# Altium schematic sheet Main control board.SchDoc
size A1
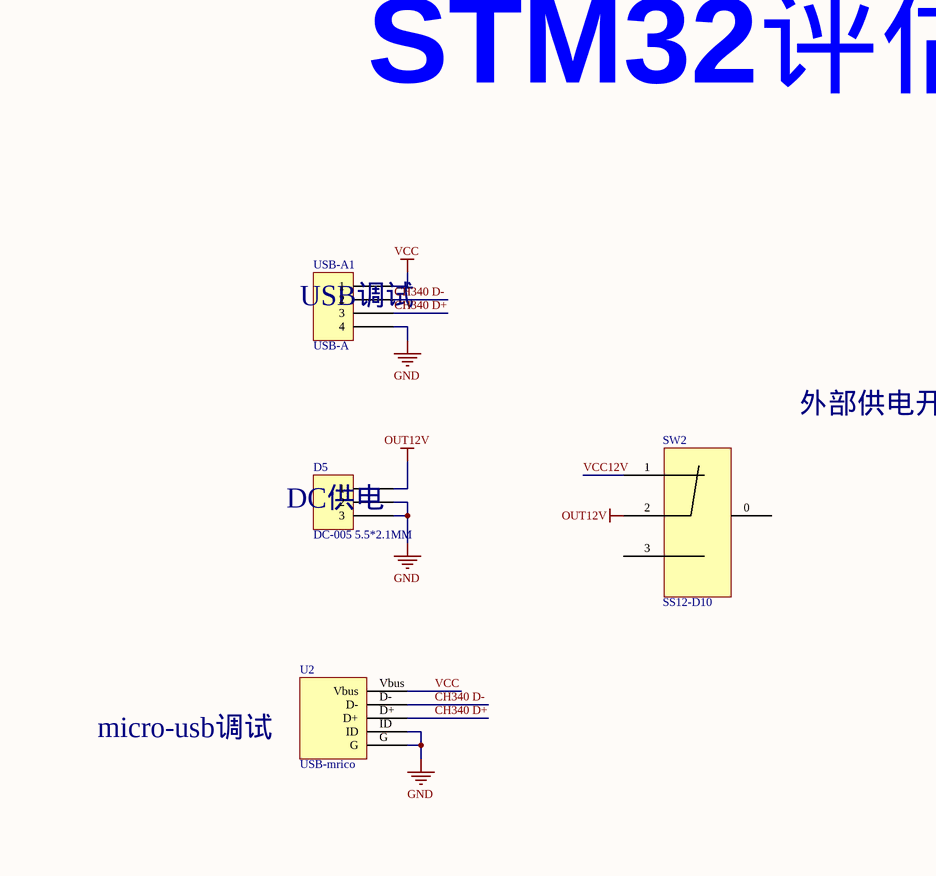
[diagram p0: Main control board.SchDoc, top left]
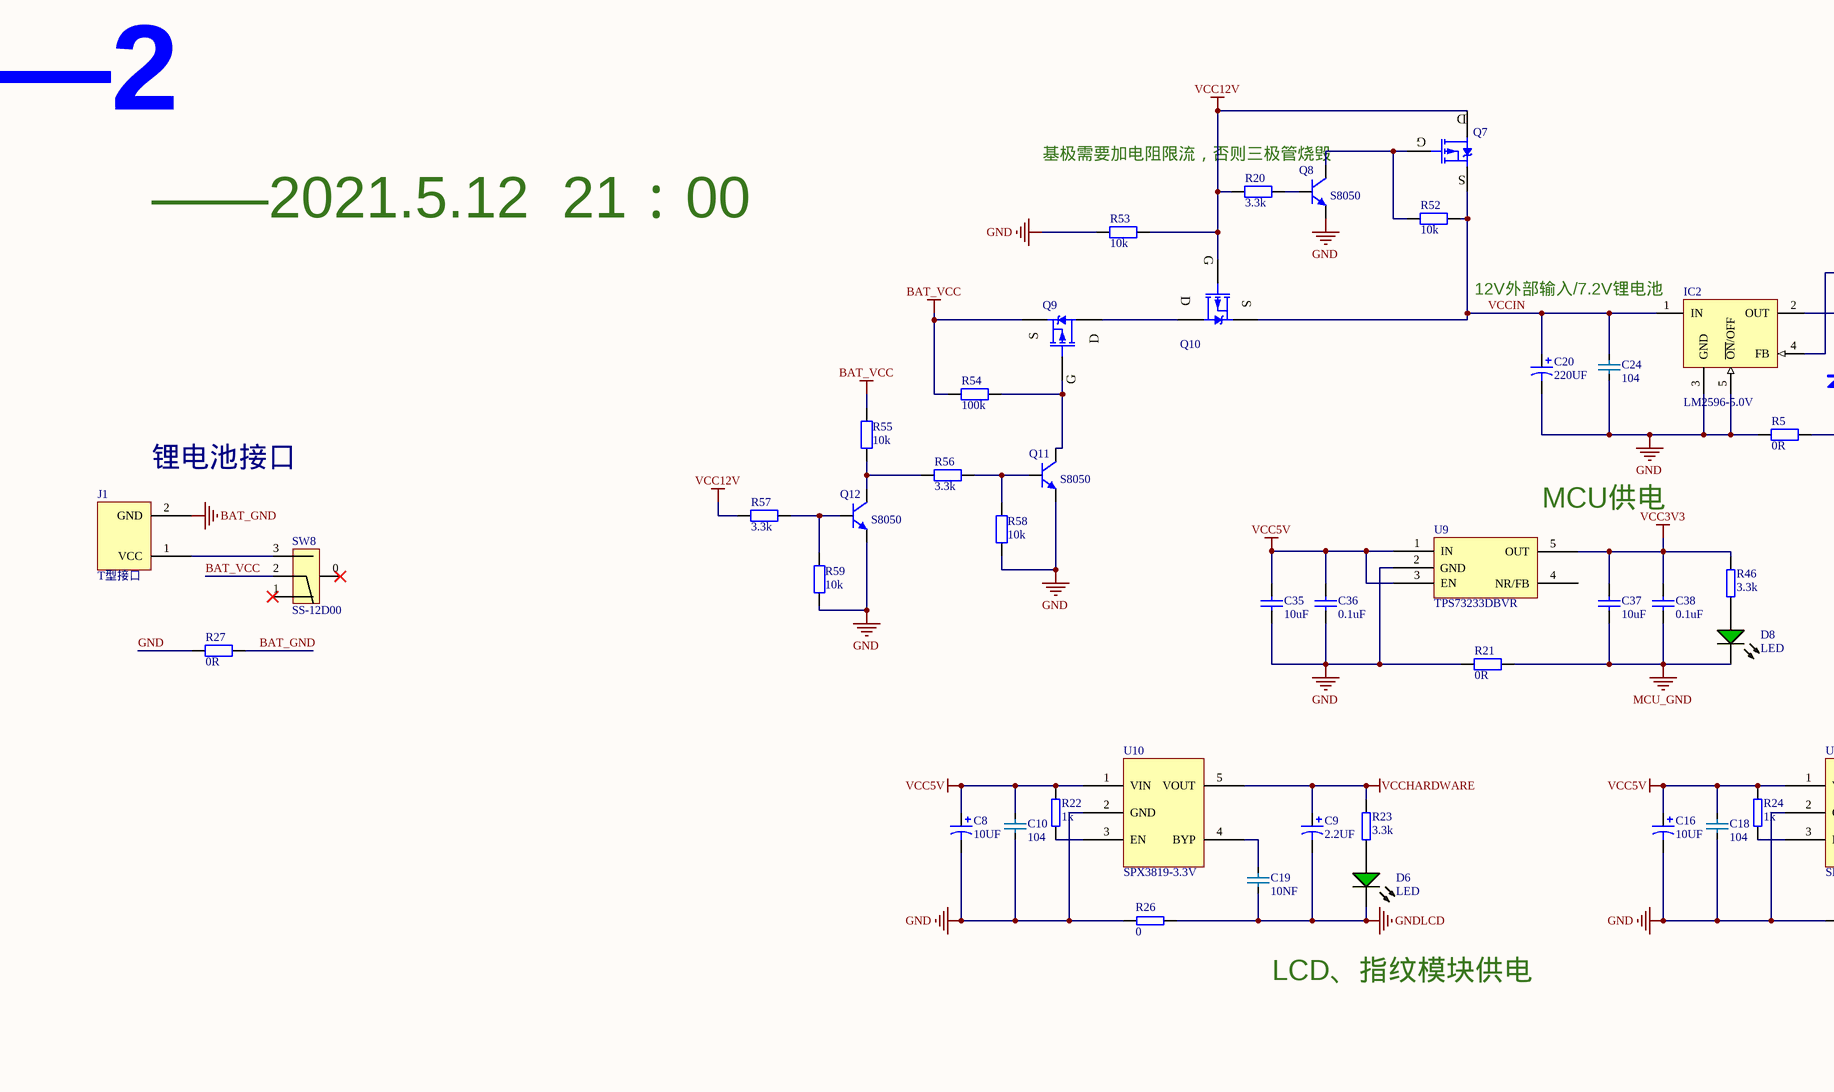
[diagram p1: Main control board.SchDoc, top middle]
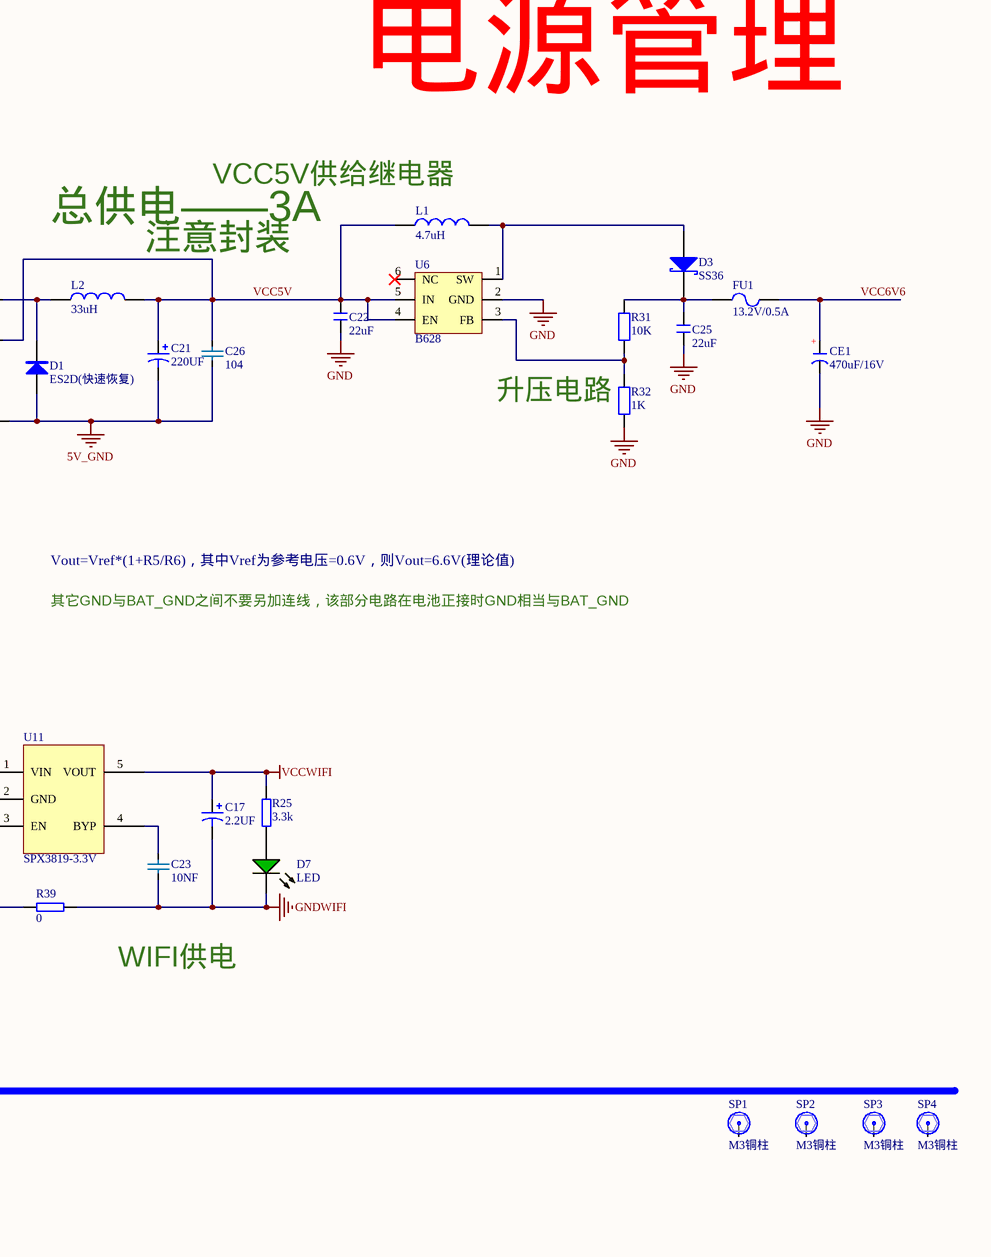
[diagram p2: Main control board.SchDoc, top right]
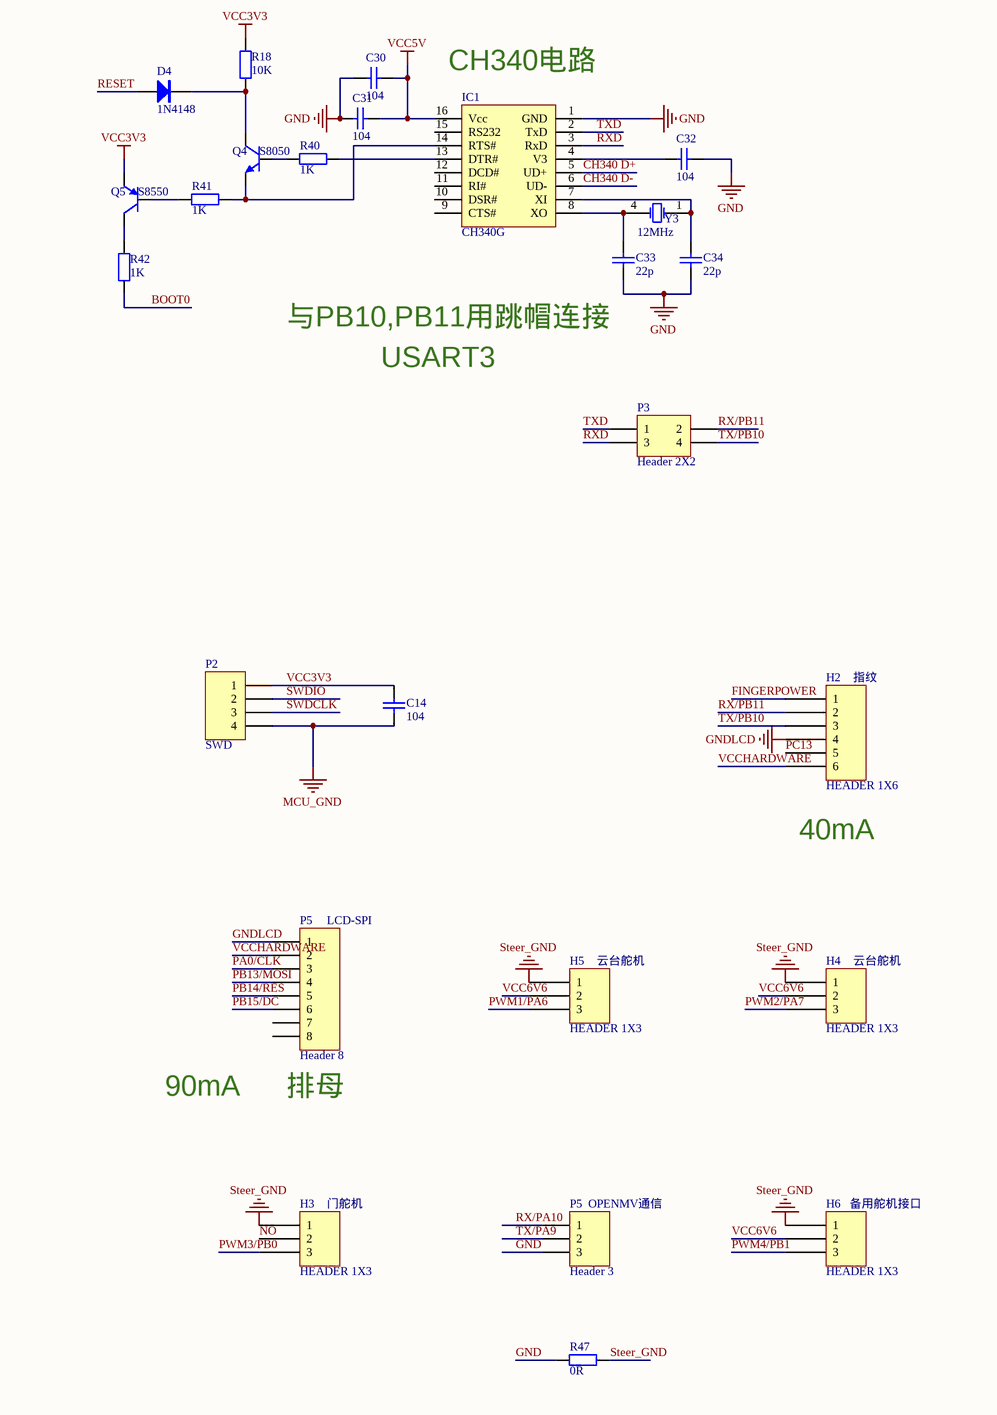
[diagram p3: Main control board.SchDoc, bottom left]
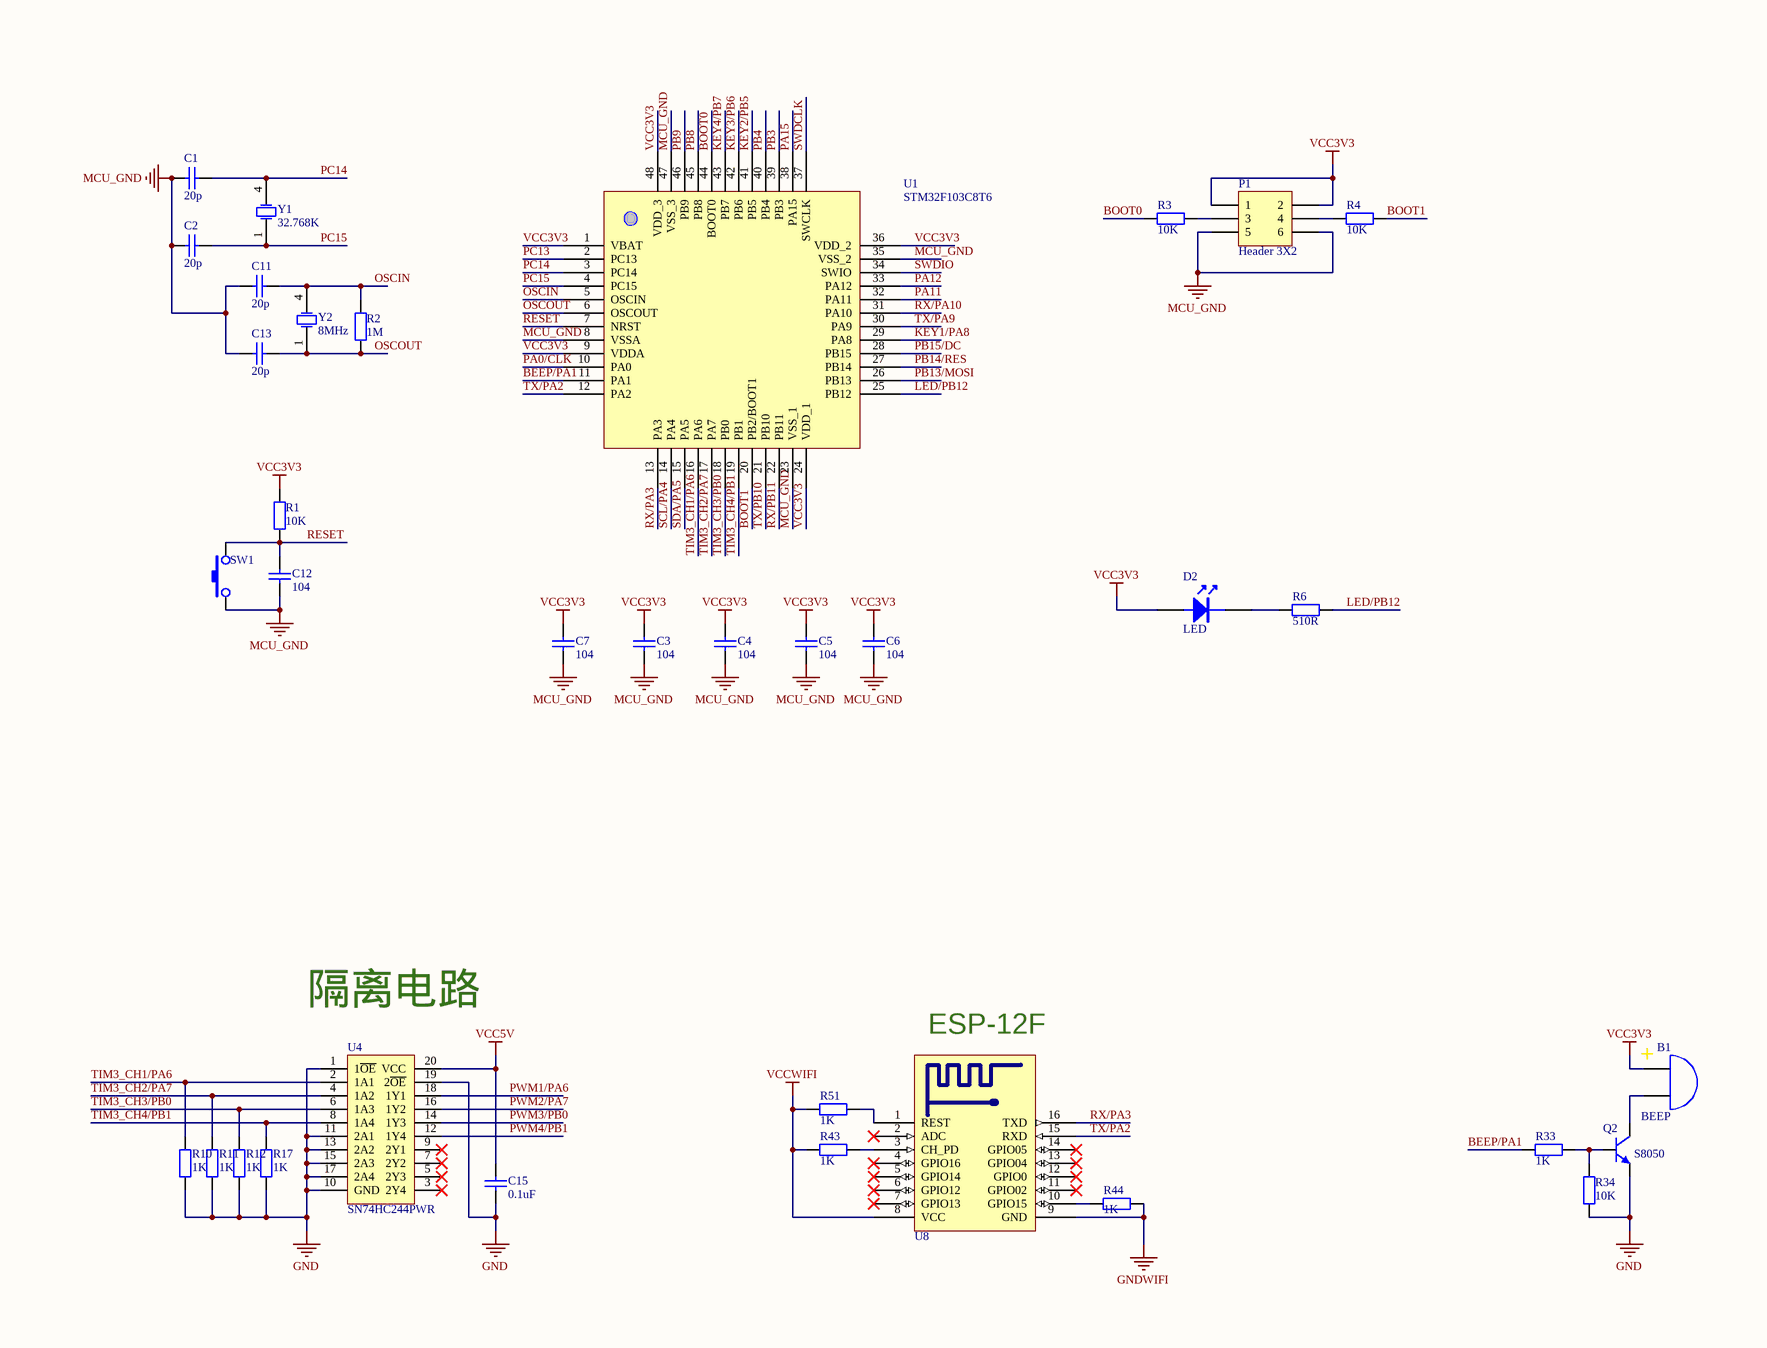
[diagram p4: Main control board.SchDoc, bottom middle]
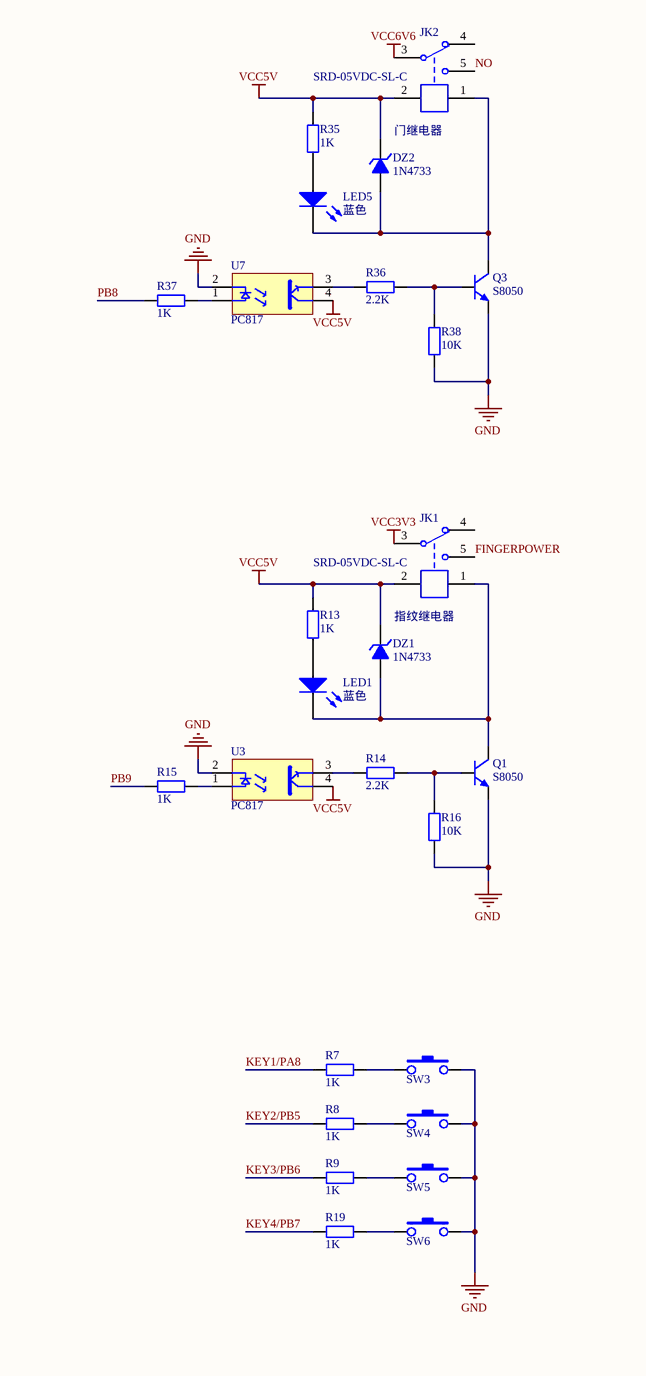
[diagram p5: Main control board.SchDoc, bottom right]

## Parts
B1  BEEP  [BEEP 7.6x12x7.5]
C1  20p  [0603C]
C2  20p  [0603C]
C3  104  [0603C]
C4  104  [0603C]
C5  104  [0603C]
C6  104  [0603C]
C7  104  [0603C]
C8  10UF  [1206C]
C9  2.2UF  [1206C]
C10  104  [0603C]
C11  20p  [0603C]
C12  104  [0603C]
C13  20p  [0603C]
C14  104  [0603C]
C15  0.1uF  [0603C]
C16  10UF  [1206C]
C17  2.2UF  [1206C]
C18  104  [0603C]
C19  10NF  [0603C]
C20  220UF  [1206C]
C21  220UF  [1206C]
C22  22uF  [0603C]
C23  10NF  [0603C]
C24  104  [0603C]
C25  22uF  [0603C]
C26  104  [0603C]
C30  104  [0603C]
C31  104  [0603C]
C32  104  [0603C]
C33  22p  [0603C]
C34  22p  [0603C]
C35  10uF  [0603C]
C36  0.1uF  [0603C]
C37  10uF  [0603C]
C38  0.1uF  [0603C]
CE1  470uF/16V  [CAP8]
D1  ES2D(快速恢复)  [SMA]
D2  LED  [LED 0805]
D3  SS36  [SMA]
D4  1N4148  [MINI_MELF (LL34)]
D5  DC-005 5.5*2.1MM  [DC-005]
D6  LED  [LED 0805G]
D7  LED  [LED 0805G]
D8  LED  [LED 0805G]
DZ1  1N4733  [MELF (LL41)]
DZ2  1N4733  [MELF (LL41)]
FU1  13.2V/0.5A  [FU 1206]
H2  HEADER 1X6  [XH2.54-LI-6P]
H3  HEADER 1X3  [XH2.54-LI-3P]
H4  HEADER 1X3  [XH2.54-LI-3P]
H5  HEADER 1X3  [XH2.54-LI-3P]
H6_备用舵机接口  HEADER 1X3  [XH2.54-LI-3P]
IC1  CH340G  [SOP16_L]
IC2  LM2596-5.0V  [TO263-5A]
J1  T型接口  [T型头封装]
JK1  SRD-05VDC-SL-C  [SRD-C_B]
JK2  SRD-05VDC-SL-C  [SRD-C_B]
L1  4.7uH  [CDRH74]
L2  33uH  [CDRH74]
LED1  蓝色  [LED 0805]
LED5  蓝色  [LED 0805]
P1  Header 3X2  [HDR2X3]
P2  SWD  [XH2.54-LI-4P]
P3  Header 2X2  [HDR2X2]
P5  Header 8  [HDR1X8]
P5_OPENMV通信  Header 3  [XH2.54-LI-3P]
Q1  S8050  [SOT23-3M]
Q2  S8050  [SOT23-3M]
Q3  S8050  [SOT23-3M]
Q4  S8050  [SOT23-3M]
Q5  S8550  [SOT23-3N]
Q7  D15P05  [TO252]  (value not drawn)
Q8  S8050  [SOT23-3M]
Q9  D15P05  [TO252]  (value not drawn)
Q10  D15P05  [TO252]  (value not drawn)
Q11  S8050  [SOT23-3M]
Q12  S8050  [SOT23-3M]
R1  10K  [0603R]
R2  1M  [0603R]
R3  10K  [0603R]
R4  10K  [0603R]
R5  0R  [0603R]
R6  510R  [0603R]
R7  1K  [0603R]
R8  1K  [0603R]
R9  1K  [0603R]
R10  1K  [0603R]
R11  1K  [0603R]
R12  1K  [0603R]
R13  1K  [0603R]
R14  2.2K  [0603R]
R15  1K  [0603R]
R16  10K  [0603R]
R17  1K  [0603R]
R18  10K  [0603R]
R19  1K  [0603R]
R20  3.3k  [0603R]
R21  0R  [0603R]
R22  1k  [0603R]
R23  3.3k  [0603R]
R24  1k  [0603R]
R25  3.3k  [0603R]
R26  0  [0603R]
R27  0R  [0603R]
R31  10K  [0603R]
R32  1K  [0603R]
R33  1K  [0603R]
R34  10K  [0603R]
R35  1K  [0603R]
R36  2.2K  [0603R]
R37  1K  [0603R]
R38  10K  [0603R]
R39  0  [0603R]
R40  1K  [0603R]
R41  1K  [0603R]
R42  1K  [0603R]
R43  1K  [0603R]
R44  1K  [0603R]
R46  3.3k  [0603R]
R47  0R  [0603R]
R51  1K  [0603R]
R52  10k  [0603R]
R53  10k  [0603R]
R54  100k  [0603R]
R55  10k  [0603R]
R56  3.3k  [0603R]
R57  3.3k  [0603R]
R58  10k  [0603R]
R59  10k  [0603R]
SP1  M3铜柱  [M3x4+6_N]
SP2  M3铜柱  [M3x4+6_N]
SP3  M3铜柱  [M3x4+6_N]
SP4  M3铜柱  [M3x4+6_N]
SW1  SW-PB_V  [TSW SMD-3*6*2.5]  (value not drawn)
SW2  SS12-D10  [SS-12D10]
SW3  SW-PB_V  [TSW SMD-3*6*2.5]  (value not drawn)
SW4  SW-PB_V  [TSW SMD-3*6*2.5]  (value not drawn)
SW5  SW-PB_V  [TSW SMD-3*6*2.5]  (value not drawn)
SW6  SW-PB_V  [TSW SMD-3*6*2.5]  (value not drawn)
SW8  SS-12D00  [SS-12D10]
U1  STM32F103C8T6  [48P]
U2  USB-mrico  [Micro_USB]
U3  PC817  [PC817C]
U4  SN74HC244PWR  [SOP20_L]
U6  B628  [B628]
U7  PC817  [PC817C]
U8  ESP-12  [ESP12]  (value not drawn)
U9  TPS73233DBVR  [SOT23-5]
U10  SPX3819-3.3V  [SOT23-5]
U11  SPX3819-3.3V  [SOT23-5]
USB-A1  USB-A  [USB-A/S_C]
Y1  32.768K  [MC-306]
Y2  8MHz  [OSC HC-49SMD]
Y3  12MHz  [OSC HC-49SMD]

## Nets
5V_GND: C21.2 C26.1 D1.1(A) R5.2
BAT_GND: J1.2(GND) R27.1
BAT_VCC: Q9.3(S) R54.1 R55.1 SW8.2
GND: C8.2 C10.1 C15.1 C16.2 C18.1 C20.2 C22.1 C24.1 C25.1 C30.2 C31.2 C32.1 C33.1 C34.1 C35.1 C36.1 CE1.2(K) D5.2 D5.3 IC1.1(GND) IC2.3(GND) IC2.5(~{ON}/OFF) P5_OPENMV通信.3 Q1.1(E) Q2.1(E) Q3.1(E) Q8.1(E) Q11.1(E) Q12.1(E) R5.1 R10.2 R11.2 R12.2 R16.2 R17.2 R21.1 R26.1 R27.2 R32.1 R34.1 R38.2 R39.1 R47.1 R53.1 R58.1 R59.2 SW3.2 SW4.2 SW5.2 SW6.2 U2.G U2.ID U3.2(IN-) U4.1(1~{OE}) U4.10(GND) U4.11(2A1) U4.13(2A2) U4.15(2A3) U4.17(2A4) U4.19(2~{OE}) U6.2(GND) U7.2(IN-) U9.2(GND) U10.2(GND) U11.2(GND) USB-A1.4
GNDLCD: C9.2 C19.1 D6.2(K) H2.4 P5.1 R26.2
GNDWIFI: C17.2 C23.1 D7.2(K) R39.2 R44.2 U8.9(GND)
MCU_GND: C1.1 C2.1 C3.1 C4.1 C5.1 C6.1 C7.1 C11.1 C12.1 C13.1 C14.1 C37.1 C38.1 D8.2(K) P1.5 P1.6 P2.4 R21.2 SW1.1 U1.8(VSSA) U1.23(VSS_1) U1.35(VSS_2) U1.47(VSS_3)
OUT12V: D5.1 SW2.2
Steer_GND: H3.1 H4.1 H5.1 H6_备用舵机接口.1 R47.2
VCC: U2.Vbus USB-A1.1
VCC3V3: B1.1 C3.2 C4.2 C5.2 C6.2 C7.2 C14.2 C37.2 C38.2 D2.A JK1.3 P1.1 P1.2 P2.1 Q5.2(E) R1.2 R18.2 R46.2 U1.1(VBAT) U1.9(VDDA) U1.24(VDD_1) U1.36(VDD_2) U1.48(VDD_3) U9.5(OUT)
VCC5V: C8.1 C10.2 C15.2 C16.1 C18.2 C21.1 C22.2 C26.2 C30.1 C31.1 C35.2 C36.2 DZ1.2(K) DZ2.2(K) IC1.16(Vcc) IC2.4(FB) JK1.2 JK2.2 L1.2 L2.1 R13.1 R22.2 R24.2 R35.1 U3.4(OUT) U4.20(VCC) U6.4(EN) U6.5(IN) U7.4(OUT) U9.1(IN) U9.3(EN) U10.1(VIN) U11.1(VIN)
VCC6V6: CE1.1(A) FU1.1 H4.2 H5.2 H6_备用舵机接口.2 JK2.3
VCC12V: Q7.2(D) Q10.1(G) R20.1 R53.2 R57.1 SW2.1
VCCHARDWARE: C9.1 H2.6 P5.2 R23.2 U10.5(VOUT)
VCCWIFI: C17.1 R25.2 R43.1 R51.1 U8.8(VCC) U11.5(VOUT)
BEEP/PA1: R33.2 U1.11(PA1)
BOOT0: R3.1 R42.1 U1.44(BOOT0)
BOOT1: R4.2 U1.20(PB2/BOOT1)
CH340 D+: IC1.5(UD+) U2.D+ USB-A1.3
CH340 D-: IC1.6(UD-) U2.D- USB-A1.2
FINGERPOWER: H2.1 JK1.5
KEY1/PA8: R7.1 U1.29(PA8)
KEY2/PB5: R8.1 U1.41(PB5)
KEY3/PB6: R9.1 U1.42(PB6)
KEY4/PB7: R19.1 U1.43(PB7)
LED/PB12: R6.2 U1.25(PB12)
NO: H3.2 JK2.5
OSCIN: C11.2 R2.2 U1.5(OSCIN) Y2.4(OSC2)
OSCOUT: C13.2 R2.1 U1.6(OSCOUT) Y2.1(OSC1)
PA0/CLK: P5.3 U1.10(PA0)
PA11: U1.32(PA11)
PA12: U1.33(PA12)
PA15: U1.38(PA15)
PB3: U1.39(PB3)
PB4: U1.40(PB4)
PB8: R37.2 U1.45(PB8)
PB9: R15.2 U1.46(PB9)
PB13/MOSI: P5.4 U1.26(PB13)
PB14/RES: P5.5 U1.27(PB14)
PB15/DC: P5.6 U1.28(PB15)
PC13: H2.5 U1.2(PC13)
PC14: C1.2 U1.3(PC14) Y1.4(OSC2)
PC15: C2.2 U1.4(PC15) Y1.1(OSC1)
PWM1/PA6: H5.3 U4.18(1Y1)
PWM2/PA7: H4.3 U4.16(1Y2)
PWM3/PB0: H3.3 U4.14(1Y3)
PWM4/PB1: H6_备用舵机接口.3 U4.12(1Y4)
RESET: C12.2 D4.1(A) R1.1 SW1.2 U1.7(NRST)
RX/PA3: U1.13(PA3) U8.16(TXD)
RX/PA10: P5_OPENMV通信.1 U1.31(PA10)
RX/PB11: H2.2 P3.2 U1.22(PB11)
RXD: IC1.3(RxD) P3.3
SCL/PA4: U1.14(PA4)
SDA/PA5: U1.15(PA5)
SWDCLK: P2.3 U1.37(SWCLK)
SWDIO: P2.2 U1.34(SWIO)
TIM3_CH1/PA6: R10.1 U1.16(PA6) U4.2(1A1)
TIM3_CH2/PA7: R11.1 U1.17(PA7) U4.4(1A2)
TIM3_CH3/PB0: R12.1 U1.18(PB0) U4.6(1A3)
TIM3_CH4/PB1: R17.1 U1.19(PB1) U4.8(1A4)
TX/PA2: U1.12(PA2) U8.15(RXD)
TX/PA9: P5_OPENMV通信.2 U1.30(PA9)
TX/PB10: H2.3 P3.4 U1.21(PB10)
TXD: IC1.2(TxD) P3.1
VCCIN: C20.1 C24.2 IC2.1(IN) Q7.3(S) Q10.3(S) R52.2
NetB1_2: B1.2 Q2.3(C)
NetC19_2: C19.2 U10.4(BYP)
NetC23_2: C23.2 U11.4(BYP)
NetC25_2: C25.2 D3.2(K) FU1.2 R31.2
NetC32_2: C32.2 IC1.4(V3)
NetC33_2: C33.2 IC1.8(XO) Y3.4(OSC2)
NetC34_2: C34.2 IC1.7(XI) Y3.1(OSC1)
NetD1_2: D1.2(K) IC2.2(OUT) L2.2
NetD2_K: D2.K R6.1
NetD3_1: D3.1(A) L1.1 U6.1(SW)
NetD4_2: D4.2(K) Q4.3(C) R18.1
NetD6_1: D6.1(A) R23.1
NetD7_1: D7.1(A) R25.1
NetD8_1: D8.1(A) R46.1
NetDZ1_1: DZ1.1(A) JK1.1 LED1.2(K) Q1.3(C)
NetDZ2_1: DZ2.1(A) JK2.1 LED5.2(K) Q3.3(C)
NetIC1_13: IC1.13(DTR#) R40.2
NetIC1_14: IC1.14(RTS#) Q4.1(E) R41.2
NetJ1_1: J1.1(VCC) SW8.3
NetLED1_1: LED1.1(A) R13.2
NetLED5_1: LED5.1(A) R35.2
NetP1_3: P1.3 R3.2
NetP1_4: P1.4 R4.1
NetQ1_2: Q1.2(B) R14.1 R16.1
NetQ2_2: Q2.2(B) R33.1 R34.2
NetQ3_2: Q3.2(B) R36.1 R38.1
NetQ4_2: Q4.2(B) R40.1
NetQ5_1: Q5.1(B) R41.1
NetQ5_3: Q5.3(C) R42.2
NetQ7_1: Q7.1(G) Q8.3(C) R52.1
NetQ8_2: Q8.2(B) R20.2
NetQ9_1: Q9.1(G) Q11.3(C) R54.2
NetQ9_2: Q9.2(D) Q10.2(D)
NetQ11_2: Q11.2(B) R56.2 R58.2
NetQ12_2: Q12.2(B) R57.2 R59.1
NetQ12_3: Q12.3(C) R55.2 R56.1
NetR7_2: R7.2 SW3.1
NetR8_2: R8.2 SW4.1
NetR9_2: R9.2 SW5.1
NetR14_2: R14.2 U3.3(OUT)
NetR15_1: R15.1 U3.1(IN+)
NetR19_2: R19.2 SW6.1
NetR22_1: R22.1 U10.3(EN)
NetR24_1: R24.1 U11.3(EN)
NetR31_1: R31.1 R32.2 U6.3(FB)
NetR36_2: R36.2 U7.3(OUT)
NetR37_1: R37.1 U7.1(IN+)
NetR43_2: R43.2 U8.3(CH_PD)
NetR44_1: R44.1 U8.10(GPIO15)
NetR51_2: R51.2 U8.1(REST)

Not connected (* = marked no-connect by the designer): IC1 9(CTS#) 10(DSR#) 11(RI#) 12(DCD#) 15(RS232); JK1 4; JK2 4; P5 7 8; SP1 1; SP2 1; SP3 1; SP4 1; SW2 0 3; SW8 0* 1*; U4 3(2Y4)* 5(2Y3)* 7(2Y2)* 9(2Y1)*; U6 6(NC)*; U8 2(ADC)* 4(GPIO16)* 5(GPIO14)* 6(GPIO12)* 7(GPIO13)* 11(GPIO02)* 12(GPIO0)* 13(GPIO04)* 14(GPIO05)*; U9 4(NR/FB)

## Notes on the sheet
- STM32评估板—2
- 电源管理
- 基极需要加电阻限流，否则三极管烧毁
- VCC5V供给继电器
- ——2021.5.12  21：00
- 总供电——3A
- (near L2) 注意封装
- USB调试
- 12V外部输入/7.2V锂电池
- 外部供电开关
- (near J1) 锂电池接口
- 升压电路
- DC供电
- (near U9) MCU供电
- Vout=Vref*(1+R5/R6)，其中Vref为参考电压=0.6V，则Vout=6.6V(理论值)
- 其它GND与BAT_GND之间不要另加连线，该部分电路在电池正接时GND相当与BAT_GND
- micro-usb调试
- (near R26) LCD、指纹模块供电
- (near R39) WIFI供电
- (near IC1) CH340电路
- 门继电器
- 与PB10,PB11用跳帽连接
- USART3
- 指纹继电器
- (near H2) 指纹
- (near H2) 40mA
- (near P5) LCD-SPI
- (near H5) 云台舵机
- (near H4) 云台舵机
- 90mA
- (near P5) 排母
- 隔离电路
- ESP-12F
- (near H3) 门舵机
- (in symbol CE) +

## Library data of the parts
B1 = BELL
C1 C2 C11 C13 C15 C33-C38 = Cap: Capacitor; Value: 104; Published: 8-Jun-2000; LatestRevisionDate: 17-Jul-2002; LatestRevisionNote: Re-released for DXP Platform.; Publisher: Altium Limited
C3-C7 C12 C14 C30-C32 = Cap: Capacitor; Published: 8-Jun-2000; LatestRevisionDate: 17-Jul-2002; LatestRevisionNote: Re-released for DXP Platform.; Publisher: Altium Limited; Value: 104
C8 C9 C16 C17 C20 C21 = CAP-ELEC
C10 C18 C19 C23 C24 C26 = CAP-0805
C22 C25 = C: 贴片电容; BOM名称: 无极性贴片电容; 淘宝ID: 封装库来自淘宝 ID：黄晶宝石; 联系售后: https://shop463601444.taobao.com
CE1 = CE: 直插电解电容; 淘宝ID: 封装库来自淘宝 ID：黄晶宝石; BOM名称: 直插电解电容; 联系售后: https://shop463601444.taobao.com
D1 = M7: 整流二极管; 版权归属: 源创客; BOM名称: 整流二极管; 学习资源: www.ooocke.com
D3 = SS14: 肖特基二极管; 属性: 40V/1A; BOM名称: 肖特基二极管; 封装库来自淘宝 ID：黄晶宝石: https://shop463601444.taobao.com
D4 = 1N4148: 高速开关二极管; 版权归属: 源创客; BOM名称: 高速开关二极管; 学习资源: www.ooocke.com
DZ1 DZ2 = 1N4733: 5.1V/1W稳压管; 版权归属: 封装库来自淘宝 ID：黄晶宝石; BOM名称: 5.1V/1W稳压管; 学习资源: www.ooocke.com
FU1 = FU: 5mm 保险丝
IC1 = CH340G: 串口转USB; 版权归属: 源创客; BOM名称: 串口转USB; 学习资源: www.ooocke.com
IC2 = LM2596-5.0: DC降压芯片; BOM名称: DC稳压芯片; 版权归属: 源创客; 学习资源: www.ooocke.com
JK1 JK2 = SRD-05VDC-SL-C: 5V一组转换; BOM名称: 5V继电器; 版权归属: 源创客; 学习资源: www.ooocke.com
L1 L2 = L: 功率电感
LED1 LED5 = LED-5MM: 直插5mm LED; BOM名称: 5mm插件LED; 版权归属: 封装库来自淘宝 ID：黄晶宝石; 学习资源: https://shop463601444.taobao.com
P1 = Header 3X2: Header, 3-Pin, Dual row; LatestRevisionDate: 17-Jul-2002; LatestRevisionNote: Re-released for DXP Platform.; Publisher: Altium Limited
P2 = Header 4: Header, 4-Pin; LatestRevisionDate: 17-Jul-2002; LatestRevisionNote: Re-released for DXP Platform.; Publisher: Altium Limited
P3 = Header 2X2: Header, 2-Pin, Dual row; LatestRevisionDate: 17-Jul-2002; LatestRevisionNote: Re-released for DXP Platform.; Publisher: Altium Limited
P5 = Header 8: Header, 8-Pin; LatestRevisionDate: 17-Jul-2002; LatestRevisionNote: Re-released for DXP Platform.; Publisher: Altium Limited
P5_OPENMV通信 = Header 3: Header, 3-Pin; LatestRevisionDate: 17-Jul-2002; LatestRevisionNote: Re-released for DXP Platform.; Publisher: Altium Limited
Q1-Q4 Q8 Q11 Q12 = 8050-DIP: 高频放大-NPN型; 版权归属: 封装库来自淘宝 ID：黄晶宝石; 属性: 40V 1.5A 1W 100MHZ; BOM名称: 高频放大-NPN型; 学习资源: https://shop463601444.taobao.com
Q5 = 8550-SMD: 高频放大-PNP型; 版权归属: 源创客; 属性: 40V 1.5A 1W 100MHZ; BOM名称: 高频放大-PNP型; 学习资源: www.ooocke.com
Q7 Q9 Q10 = D15P05: P沟道场效应管; 版权归属: 源创客; BOM名称: P沟道场效应管; 学习资源: www.ooocke.com
R1-R6 R18 R20 R21 R27 R33 R34 R40-R44 R47 R51-R59 = Res2: Resistor; Published: 8-Jun-2000; LatestRevisionDate: 17-Jul-2002; LatestRevisionNote: Re-released for DXP Platform.; Publisher: Altium Limited
R7-R14 R16 R17 R19 R35 R36 R38 = R-S: 色环电阻; 版权归属: 封装库来自淘宝 ID：黄晶宝石; BOM名称: 色环电阻; 联系售后: https://shop463601444.taobao.com
R15 R31 R32 R37 = R: 贴片电阻; 版权归属: 来自淘宝 ID：黄晶宝石; BOM名称: 贴片电阻; 联系售后: https://shop463601444.taobao.com
R22-R25 R46 = RES
R26 R39 = RES0805
SP1-SP4 = 铜柱加头大焊盘: 铜柱; 版权归属: 源创客; BOM名称: 铜柱; 学习资源: www.ooocke.com
SW1 SW3-SW6 = SW-PB_V: SWITCH
SW2 = SS12-F23
SW8 = SS-12D00: 拨动开关
U2 = usb-STM
U3 U7 = PC817C: 贴片光耦
U4 = SN74HC244PWR: 三态输出的八路缓冲器和线路驱动器 TSSOP-20
U6 = B628: 升压IC
U9 = TPS73233DBVR: LDO
U10 U11 = SPX3819
Y1-Y3 = XTAL: Crystal Oscillator; Published: 8-Jun-2000; LatestRevisionDate: 17-Jul-2002; LatestRevisionNote: Re-released for DXP Platform.; Publisher: Altium Limited